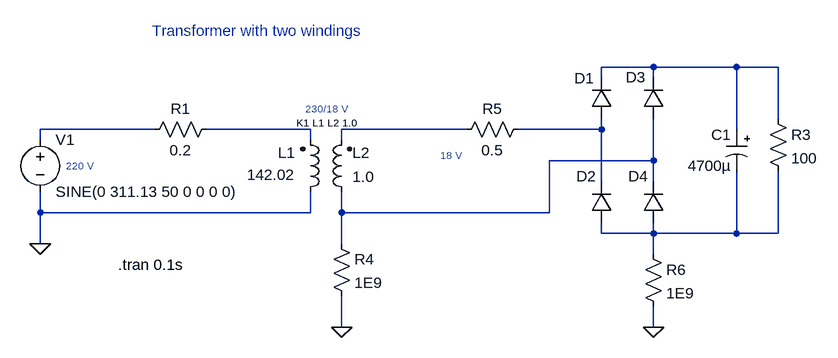
[diagram p0: schematic powersupply.asc]
powersupply.asc, the LTspice schematic file:
Version 4
SHEET 1 1284 680
WIRE 640 80 560 80
WIRE 768 80 640 80
WIRE 832 80 768 80
WIRE 560 96 560 80
WIRE 640 96 640 80
WIRE 832 160 832 80
WIRE -128 176 -304 176
WIRE 112 176 -48 176
WIRE 352 176 160 176
WIRE 560 176 560 160
WIRE 560 176 432 176
WIRE 768 176 768 80
WIRE -304 192 -304 176
WIRE 112 192 112 176
WIRE 160 192 160 176
WIRE 640 224 640 160
WIRE 640 224 480 224
WIRE 560 256 560 176
WIRE 640 256 640 224
WIRE -304 304 -304 272
WIRE 112 304 112 272
WIRE 112 304 -304 304
WIRE 160 304 160 272
WIRE 480 304 480 224
WIRE 480 304 160 304
WIRE 560 336 560 320
WIRE 640 336 640 320
WIRE 640 336 560 336
WIRE 768 336 768 240
WIRE 768 336 640 336
WIRE 832 336 832 240
WIRE 832 336 768 336
WIRE -304 352 -304 304
WIRE 160 352 160 304
WIRE 640 368 640 336
WIRE 160 480 160 432
WIRE 640 480 640 448
FLAG 160 480 0
FLAG -304 352 0
FLAG 640 480 0
SYMBOL ind2 96 288 M180
WINDOW 0 -7 76 Right 2
WINDOW 3 -7 42 Right 2
SYMATTR InstName L1
SYMATTR Value 142.02
SYMATTR Type ind
SYMBOL voltage -304 176 R0
WINDOW 123 0 0 Left 2
WINDOW 39 0 0 Left 2
SYMATTR InstName V1
SYMATTR Value SINE(0 311.13 50 0 0 0 0)
SYMBOL res -32 160 R90
WINDOW 0 0 56 VBottom 2
WINDOW 3 32 56 VTop 2
SYMATTR InstName R1
SYMATTR Value 0.2
SYMBOL ind2 176 288 R180
WINDOW 0 -1 76 Right 2
WINDOW 3 -1 39 Right 2
SYMATTR InstName L2
SYMATTR Value 1.0
SYMATTR Type ind
SYMBOL res 144 336 R0
SYMATTR InstName R4
SYMATTR Value 1E9
SYMBOL diode 576 160 R180
WINDOW 0 27 63 Left 2
WINDOW 3 24 0 Invisible 2
SYMATTR InstName D1
SYMATTR Value MURS320
SYMBOL diode 576 320 R180
WINDOW 0 24 72 Left 2
WINDOW 3 24 0 Invisible 2
SYMATTR InstName D2
SYMATTR Value MURS320
SYMBOL diode 656 160 R180
WINDOW 0 28 64 Left 2
WINDOW 3 24 0 Invisible 2
SYMATTR InstName D3
SYMATTR Value MURS320
SYMBOL diode 656 320 R180
WINDOW 0 24 72 Left 2
WINDOW 3 24 0 Invisible 2
SYMATTR InstName D4
SYMATTR Value MURS320
SYMBOL polcap 784 176 M0
WINDOW 3 24 56 Left 2
SYMATTR Value 4700µ
SYMATTR InstName C1
SYMATTR Description Capacitor
SYMATTR Type cap
SYMATTR SpiceLine V=16 Irms=2.17 Rser=0.035 Lser=0
SYMBOL res 816 144 R0
SYMATTR InstName R3
SYMATTR Value 100
SYMBOL res 336 192 R270
WINDOW 0 32 56 VTop 2
WINDOW 3 0 56 VBottom 2
SYMATTR InstName R5
SYMATTR Value 0.5
SYMBOL res 624 352 R0
SYMATTR InstName R6
SYMATTR Value 1E9
TEXT 136 176 Bottom 1 !K1 L1 L2 1.0
TEXT -184 384 Left 2 !.tran 0.1s
TEXT 32 40 Bottom 2 ;Transformer with two windings
TEXT 104 144 Left 1 ;230/18 V
TEXT -264 232 Left 1 ;220 V
TEXT 312 216 Left 1 ;18 V

The netlist it stands for:
* powersupply.asc
L1 0 N003 142.02
V1 N002 0 SINE(0 311.13 50 0 0 0 0)
R1 N003 N002 0.2
L2 N006 N004 1.0
R4 N006 0 1E9
D1 N005 N001 MURS320
D2 N007 N005 MURS320
D3 N006 N001 MURS320
D4 N007 N006 MURS320
C1 N001 N007 4700µ V=16 Irms=2.17 Rser=0.035 Lser=0
R3 N001 N007 100
R5 N004 N005 0.5
R6 N007 0 1E9
.model D D
.lib standard.dio
K1 L1 L2 1.0
.tran 0.1s
* Transformer with two windings
* 230/18 V
* 220 V
* 18 V
.backanno
.end